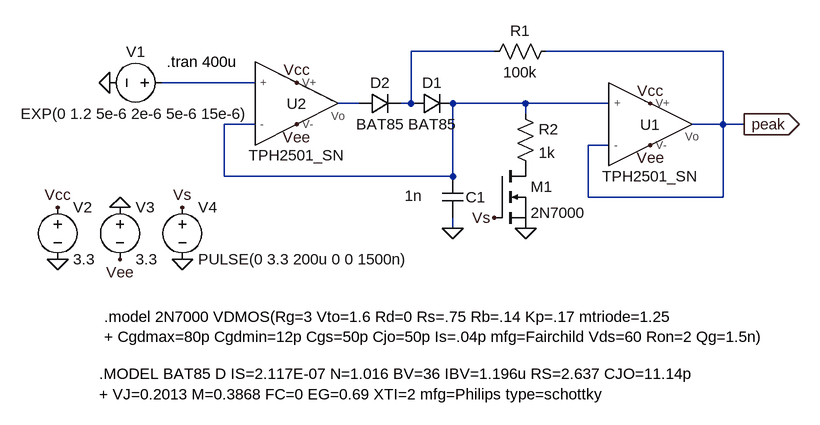
[diagram p0: schematic detectorCosmicWatchV3.asc]
detectorCosmicWatchV3.asc, the LTspice schematic file:
Version 4
SHEET 1 1700 680
WIRE 464 80 336 80
WIRE 816 80 544 80
WIRE 96 128 -48 128
WIRE 256 160 224 160
WIRE 336 160 336 80
WIRE 336 160 320 160
WIRE 512 160 400 160
WIRE 640 160 512 160
WIRE 512 176 512 160
WIRE 96 192 48 192
WIRE 816 192 816 80
WIRE 816 192 768 192
WIRE 848 192 816 192
WIRE 640 224 608 224
WIRE 48 272 48 192
WIRE 400 272 400 160
WIRE 400 272 48 272
WIRE 608 304 608 224
WIRE 816 304 816 192
WIRE 816 304 608 304
WIRE 400 352 400 336
FLAG 400 352 0
FLAG -128 128 0
FLAG -112 320 0
FLAG -208 400 0
FLAG -208 320 Vcc
FLAG 160 128 Vcc
FLAG 704 160 Vcc
FLAG -112 400 Vee
FLAG 160 192 Vee
FLAG 704 224 Vee
FLAG 848 192 peak
IOPIN 848 192 Out
FLAG 512 352 0
FLAG -16 400 0
FLAG -16 320 Vs
FLAG 464 336 Vs
SYMBOL diode 336 176 R270
WINDOW 0 32 32 VTop 2
WINDOW 3 0 32 VBottom 2
SYMATTR InstName D1
SYMATTR Value BAT85
SYMBOL diode 256 176 R270
WINDOW 0 32 32 VTop 2
WINDOW 3 0 32 VBottom 2
SYMATTR InstName D2
SYMATTR Value BAT85
SYMBOL res 448 96 R270
WINDOW 0 32 56 VTop 2
WINDOW 3 0 56 VBottom 2
SYMATTR InstName R1
SYMATTR Value 100k
SYMBOL cap 384 272 R0
WINDOW 0 36 32 Left 2
WINDOW 3 -58 30 Left 2
SYMATTR InstName C1
SYMATTR Value 1n
SYMATTR SpiceLine Rser=395.4m Lser=0 mfg="KEMET" pn="C0402C103K7PAC" type="X5R"
SYMBOL voltage -208 304 R0
WINDOW 123 0 0 Left 0
WINDOW 39 0 0 Left 0
SYMATTR InstName V2
SYMATTR Value 3.3
SYMBOL voltage -112 304 R0
WINDOW 123 0 0 Left 0
WINDOW 39 0 0 Left 0
SYMATTR InstName V3
SYMATTR Value 3.3
SYMBOL nmos 464 256 R0
SYMATTR InstName M1
SYMATTR Value 2N7000
SYMBOL Voltage -32 128 R90
WINDOW 0 -32 56 VBottom 2
WINDOW 3 32 56 VTop 2
SYMATTR InstName V1
SYMATTR Value EXP(0 1.2 5e-6 2e-6 5e-6 15e-6)
SYMBOL Res 496 160 R0
SYMATTR InstName R2
SYMATTR Value 1k
SYMBOL Voltage -16 304 R0
SYMATTR InstName V4
SYMATTR Value PULSE(0 3.3 200u 0 0 1500n)
SYMBOL TPH2501_SN 640 192 R0
SYMATTR InstName U1
SYMBOL TPH2501_SN 96 160 R0
SYMATTR InstName U2
TEXT -40 96 Left 2 !.tran 400u
TEXT -136 488 Left 2 !.model 2N7000 VDMOS(Rg=3 Vto=1.6 Rd=0 Rs=.75 Rb=.14 Kp=.17 mtriode=1.25 \n+ Cgdmax=80p Cgdmin=12p Cgs=50p Cjo=50p Is=.04p mfg=Fairchild Vds=60 Ron=2 Qg=1.5n)
TEXT -144 576 Left 2 !.MODEL BAT85 D IS=2.117E-07 N=1.016 BV=36 IBV=1.196u RS=2.637 CJO=11.14p \n+ VJ=0.2013 M=0.3868 FC=0 EG=0.69 XTI=2 mfg=Philips type=schottky

The netlist it stands for:
* detectorCosmicWatchV3.asc
D1 N001 N004 BAT85
D2 N003 N001 BAT85
R1 N001 peak 100k
C1 N004 0 1n Rser=395.4m Lser=0 mfg="KEMET" pn="C0402C103K7PAC" type="X5R"
V2 Vcc 0 3.3
V3 0 Vee 3.3
M1 P001 Vs 0 0 2N7000
V1 N002 0 EXP(0 1.2 5e-6 2e-6 5e-6 15e-6)
R2 N004 P001 1k
V4 Vs 0 PULSE(0 3.3 200u 0 0 1500n)
XU1 N004 peak Vcc Vee peak TPH2501_SN  ; pins + - V+ V- Vo
XU2 N002 N004 Vcc Vee N003 TPH2501_SN  ; pins + - V+ V- Vo
.model D D
.lib standard.dio
.model NMOS NMOS
.model PMOS PMOS
.lib standard.mos
.tran 400u
.model 2N7000 VDMOS(Rg=3 Vto=1.6 Rd=0 Rs=.75 Rb=.14 Kp=.17 mtriode=1.25
+ Cgdmax=80p Cgdmin=12p Cgs=50p Cjo=50p Is=.04p mfg=Fairchild Vds=60 Ron=2 Qg=1.5n)
.MODEL BAT85 D IS=2.117E-07 N=1.016 BV=36 IBV=1.196u RS=2.637 CJO=11.14p
+ VJ=0.2013 M=0.3868 FC=0 EG=0.69 XTI=2 mfg=Philips type=schottky
.lib /Users/jing.liu/spice/SiPM/peak/TPH2501_SN.lib
.backanno
.end